# EAGLE schematic ac_dc (EAGLE 6.2)
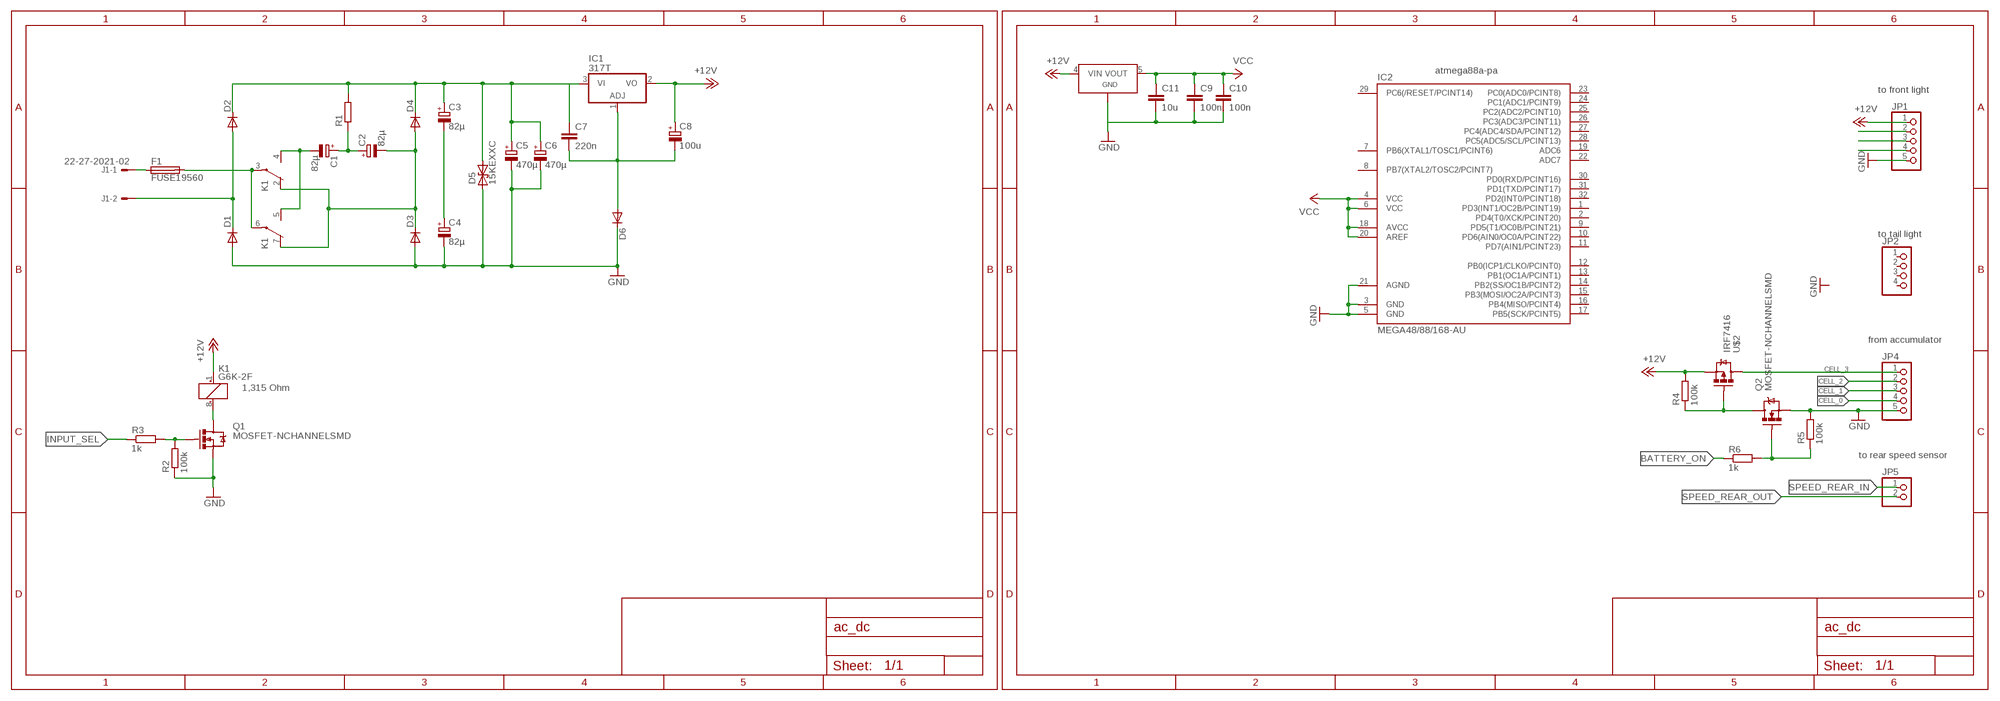
[diagram p0: schematic, sheet 1]

## Parts
C1  82µ  CPOL-EU175TMP-0808  [175TMP-0808]
C2  82µ  CPOL-EU175TMP-0808  [175TMP-0808]
C3  82µ  CPOL-EU175TMP-0808  [175TMP-0808]
C4  82µ  CPOL-EU175TMP-0808  [175TMP-0808]
C5  470µ  CPOL-EU153CLV-1014  [153CLV-1014]
C6  470µ  CPOL-EU153CLV-1014  [153CLV-1014]
C7  220n  C-EUC0805  [C0805]
C8  100u  CPOL-EUE  [PANASONIC_E]
C9  100n  C-EUC0805  [C0805]
C10  100n  C-EUC0805  [C0805]
C11  10u  C-EUC1206  [C1206]
D1  DIODE-DO-214AC  [DO-214AC]
D2  DIODE-DO-214AC  [DO-214AC]
D3  DIODE-DO-214AC  [DO-214AC]
D4  DIODE-DO-214AC  [DO-214AC]
D5  15KEXXC  [CB429-17]
D6  DIODE-MINIMELF  [MINIMELF]
F1  FUSE19560  [19560]
IC1  317T  [TO220H]
IC2  MEGA48/88/168-AU  [TQFP32-08]
J1  22-27-2021-02  [6410-02]
JP1  PINHD-1X5  [1X05]
JP2  PINHD-1X4  [1X04]
JP4  PINHD-1X5  [1X05]
JP5  PINHD-1X2  [1X02]
K1  G6K-2F  [G6K-2F]
Q1  MOSFET-NCHANNELSMD  [SOT23-3]
Q2  MOSFET-NCHANNELSMD  [SOT23-3]
R1  R-EU_R1206  [R1206]
R2  100k  R-EU_R0805  [R0805]
R3  1k  R-EU_R0805  [R0805]
R4  100k  R-EU_R0805  [R0805]
R5  100k  R-EU_R0805  [R0805]
R6  1k  R-EU_R0805  [R0805]
U$1  TPS71530  [SOT23-DBV]
U$2  IRF7416  [SO8-2]

## Nets
+12V: C8.+ IC1.2(VO) JP1.1 K1.1(1:+) R4.2 U$1.4(VIN) U$2.1(S1) U$2.2(S1) U$2.3(S1)
BATTERY_ON: R6.1
CELL_0: JP4.4
CELL_1: JP4.3
CELL_2: JP4.2
CELL_3: JP4.1 U$2.5(D1) U$2.6(D1) U$2.7(D1) U$2.8(D1)
GND: C4.- C5.- C6.- C9.2 C10.2 C11.2 D1.A D3.A D5.A D6.C IC2.3(GND) IC2.5(GND) IC2.21(AGND) JP1.5 JP4.5 Q1.2(S) Q2.2(S) R2.1 R5.2 U$1.2(GND)
INPUT_SEL: R3.1
N$1: C3.- C4.+
N$2: C2.- D3.C D4.A K1.2(2:O) K1.7(3:O)
N$3: C1.+ C2.+ R1.1
N$4: D1.C D2.A J1.2
N$5: C3.+ C5.+ C6.+ C7.1 D2.C D4.C D5.C IC1.3(VI) R1.2
N$6: C1.- K1.4(2:S) K1.5(3:S)
N$7: JP1.2
N$8: F1.2 K1.3(2:P) K1.6(3:P)
N$9: F1.1 J1.1
N$10: C7.2 C8.- D6.A IC1.1(ADJ)
N$11: JP1.3
N$12: JP1.4
N$14: K1.8(1:-) Q1.3(D)
N$15: Q1.1(G) R2.2 R3.2
N$16: Q2.3(D) R4.1 U$2.4(G)
N$17: Q2.1(G) R5.1 R6.2
SPEED_REAR_IN: JP5.1
SPEED_REAR_OUT: JP5.2
VCC: C9.1 C10.1 C11.1 IC2.4(VCC) IC2.6(VCC) IC2.18(AVCC) IC2.20(AREF) U$1.5(VOUT)
Unconnected: IC2.1(PD3(INT1/OC2B/PCINT19)) IC2.2(PD4(T0/XCK/PCINT20)) IC2.7(PB6(XTAL1/TOSC1/PCINT6)) IC2.8(PB7(XTAL2/TOSC2/PCINT7)) IC2.9(PD5(T1/OC0B/PCINT21)) IC2.10(PD6(AIN0/OC0A/PCINT22)) IC2.11(PD7(AIN1/PCINT23)) IC2.12(PB0(ICP1/CLKO/PCINT0)) IC2.13(PB1(OC1A/PCINT1)) IC2.14(PB2(SS/OC1B/PCINT2)) IC2.15(PB3(MOSI/OC2A/PCINT3)) IC2.16(PB4(MISO/PCINT4)) IC2.17(PB5(SCK/PCINT5)) IC2.19(ADC6) IC2.22(ADC7) IC2.23(PC0(ADC0/PCINT8)) IC2.24(PC1(ADC1/PCINT9)) IC2.25(PC2(ADC2/PCINT10)) IC2.26(PC3(ADC3/PCINT11)) IC2.27(PC4(ADC4/SDA/PCINT12)) IC2.28(PC5(ADC5/SCL/PCINT13)) IC2.29(PC6(/RESET/PCINT14)) IC2.30(PD0(RXD/PCINT16)) IC2.31(PD1(TXD/PCINT17)) IC2.32(PD2(INT0/PCINT18)) JP2.1 JP2.2 JP2.3 JP2.4

## Notes on the sheet
- atmega88a-pa
- to front light
- to tail light
- from accumulator
- 1,315 Ohm
- to rear speed sensor

## Library data of the parts
C1-C6 C8 = resistor:CPOL-EU: POLARIZED CAPACITOR, European symbol
C7 C9-C11 = resistor:C-EU: CAPACITOR, European symbol
D1-D4 D6 = diode:DIODE-: DIODE
D5 = diode:15KEXXC: DIODE
F1 = fuse:FUSE: Fuse; MPN: 56000001009; OC_FARNELL: 1185363; OC_NEWARK: 98K6125
IC1 = linear:*317: Positive VOLTAGE REGULATOR
IC2 = avr-7:MEGA48/88/168
J1 = con-molex:22-?-02: CONNECTOR wire to board 2.54 mm (.1 inch) pitch header; OC_FARNELL: unknown; OC_NEWARK: unknown
JP1 JP4 = pinhead:PINHD-1X5: PIN HEADER
JP2 = pinhead:PINHD-1X4: PIN HEADER
JP5 = pinhead:PINHD-1X2: PIN HEADER
K1 = relay:G6K: Low Signal Relay oeiwcsnts1.omron.com/.. D20G6K0100.pdf; MF: OMRON COMPONENTS USA; MPN: G6K-2F DC24; OC_FARNELL: 1690427; OC_NEWARK: 36K7467
Q1 Q2 = SparkFun:MOSFET-NCHANNEL
R1-R6 = resistor:R-EU_: RESISTOR, European symbol
U$1 = ShortCircuitRobotics:TPS71530
U$2 = ShortCircuitRobotics:IRF7416